# Altium schematic sheet sar20-baseboard-Power.SchDoc
size A4
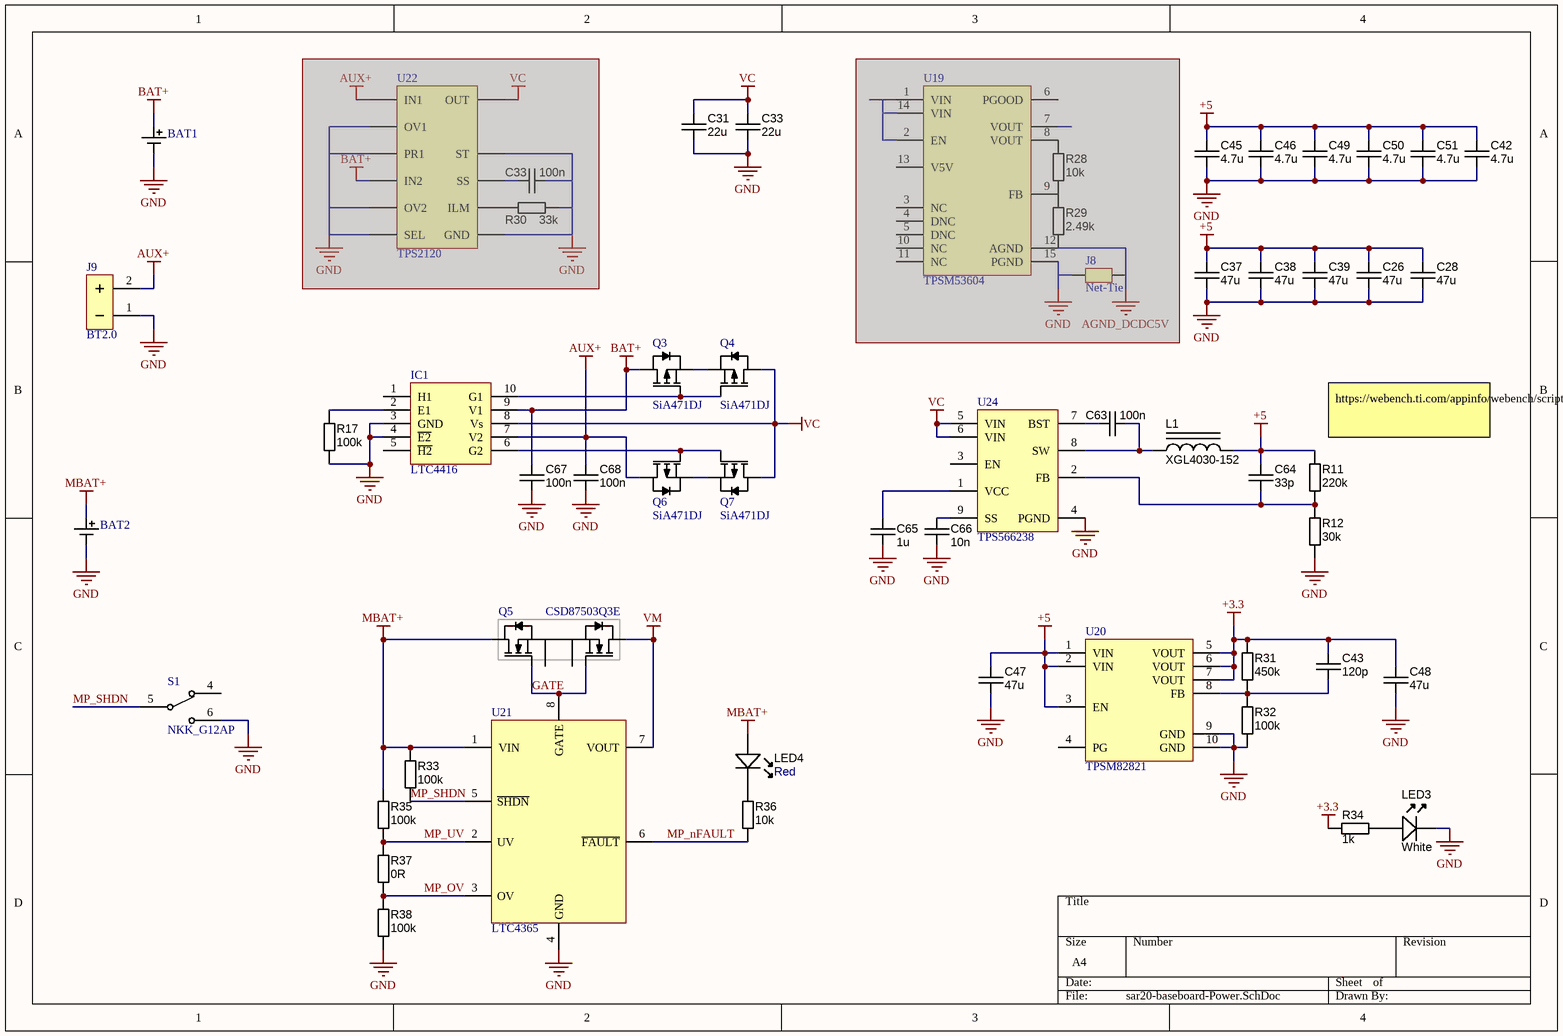
[diagram p0: sar20-baseboard-Power.SchDoc]

## Parts
(Parts that share a designator on the sheet are numbered #1, #2 ... from top to bottom, then left to right.)
BAT1  CUSTOM_BATTERY  [CUSTOM_BATTERY]  (value not drawn)
BAT2  CUSTOM_BATTERY  [CUSTOM_BATTERY]  (value not drawn)
C26  value 47u  [CAPC3216X180N]  (hidden comment: approved sub OK)
C28  value 47u  [CAPC3216X180N]  (hidden comment: approved sub OK)
C31  value 22u  [CAPC3216X180N]  (hidden comment: approved sub OK)
C33#1  value 22u  [CAPC3216X180N]  (hidden comment: approved sub OK)
C33#2  value 100n  [CAPC0603X04N]  (hidden comment: CAPC_100n_0201)  (masked out: inside a compile mask, not in the netlist)
C37  value 47u  [CAPC3216X180N]  (hidden comment: approved sub OK)
C38  value 47u  [CAPC3216X180N]  (hidden comment: approved sub OK)
C39  value 47u  [CAPC3216X180N]  (hidden comment: approved sub OK)
C42  value 4.7u  [CAPC1608X90N]  (hidden comment: approved sub OK)
C43  120p  [CAPC1005X55N]
C45  value 4.7u  [CAPC1608X90N]  (hidden comment: approved sub OK)
C46  value 4.7u  [CAPC1608X90N]  (hidden comment: approved sub OK)
C47  value 47u  [CAPC3216X180N]  (hidden comment: approved sub OK)
C48  value 47u  [CAPC3216X180N]  (hidden comment: approved sub OK)
C49  value 4.7u  [CAPC1608X90N]  (hidden comment: approved sub OK)
C50  value 4.7u  [CAPC1608X90N]  (hidden comment: approved sub OK)
C51  value 4.7u  [CAPC1608X90N]  (hidden comment: approved sub OK)
C63  100n  [CAPC1005X55N]
C64  33p  [CAPC1005X55N]
C65  1u  [CAPC1005X55N]
C66  10n  [CAPC1005X55N]
C67  100n  [CAPC1005X55N]
C68  100n  [CAPC1005X55N]
IC1  LTC4416  [MSOP-10_SMALL_PADS]
J8  Net-Tie  [NET-TIE-0803]  (net tie, no BOM)  (masked out: inside a compile mask, not in the netlist)
J9  BT2.0  [BT2.0-M]
L1  XGL4030-152  [XGL4030]
LED3  White  [LED-0603-WHITE]
LED4  Red  [LED-0603-GREEN]
Q3  SiA471DJ  [VISHAY_PowerPAK_SC70-6L_SINGLE]
Q4  SiA471DJ  [VISHAY_PowerPAK_SC70-6L_SINGLE]
Q5  CSD87503Q3E  [TI_CSD87503Q3E_SON3x3_DTD]
Q6  SiA471DJ  [VISHAY_PowerPAK_SC70-6L_SINGLE]
Q7  SiA471DJ  [VISHAY_PowerPAK_SC70-6L_SINGLE]
R11  value 220k  [RESC1005X40N]  (hidden comment: Thick Film)
R12  value 30k  [RESC1005X40N]  (hidden comment: Thick Film)
R17  value 100k  [RESC1005X40N]  (hidden comment: Thick Film)
R28  value 10k  [RESC1005X40N]  (hidden comment: Thick Film)  (masked out: inside a compile mask, not in the netlist)
R29  value 2.49k  [RESC1005X40N]  (hidden comment: Thick Film)  (masked out: inside a compile mask, not in the netlist)
R30  value 33k  [RESC0603X03N]  (hidden comment: RESC_0201)  (masked out: inside a compile mask, not in the netlist)
R31  value 450k  [RESC1005X40N]  (hidden comment: Thick Film)
R32  value 100k  [RESC1005X40N]  (hidden comment: Thick Film)
R33  value 100k  [RESC1005X40N]  (hidden comment: Thick Film)
R34  value 1k  [RESC1005X40N]  (hidden comment: Thick Film)
R35  value 100k  [RESC1005X40N]  (hidden comment: Thick Film)
R36  value 10k  [RESC1005X40N]  (hidden comment: Thick Film)
R37  value 0R  [RESC1005X40N]  (hidden comment: Thick Film)
R38  value 100k  [RESC1005X40N]  (hidden comment: Thick Film)
S1  NKK_G12AP  [G12AP]
U19  TPSM53604  [TI_B3QFN]  (masked out: inside a compile mask, not in the netlist)
U20  TPSM82821  [TI_uSIP_SIL0010D]
U21  LTC4365  [SOT23-8]
U22  TPS2120  [TI_DSBGA_YFP0020]  (masked out: inside a compile mask, not in the netlist)
U24  TPS566238  [TI_VQFN-HR_RQF0009A]

## Nets
+3.3: C43.1 C48.1 R31.1 R34.1 U20.5(VOUT) U20.6(VOUT) U20.7(VOUT)
+5: C26.1 C28.1 C37.1 C38.1 C39.1 C42.1 C45.1 C46.1 C47.1 C49.1 C50.1 C51.1 C64.2 L1.2 R11.2 U20.1(VIN) U20.2(VIN) U20.3(EN)
AUX+: C68.2 IC1.7(V2) J9.2(+) Q6.D
BAT+: BAT1.PLUS C67.2 IC1.9(V1) Q3.D
GND: BAT1.MINUS BAT2.MINUS C26.2 C28.2 C31.2 C33#1.2 C37.2 C38.2 C39.2 C42.2 C45.2 C46.2 C47.2 C48.2 C49.2 C50.2 C51.2 C65.1 C66.1 C67.1 C68.1 IC1.3(GND) IC1.4(~{E2}) J9.1(-) LED3.K R12.1 R17.2 R32.2 R38.2 S1.6 U20.9(GND) U20.10(GND) U21.4(GND) U24.4(PGND)
MBAT+: BAT2.PLUS LED4.A Q5.D1 R33.1 R35.1 U21.1(VIN)
VC: C31.1 C33#1.1 IC1.8(Vs) Q4.D Q7.D U24.5(VIN) U24.6(VIN)
VM: Q5.D2 U21.7(VOUT)
GATE: Q5.G1 Q5.G2 U21.8(GATE)
MP_nFAULT: R36.2 U21.6(~{FAULT})
MP_OV: R37.2 R38.1 U21.3(OV)
MP_SHDN: R33.2 S1.5 U21.5(~{SHDN})
MP_UV: R35.2 R37.1 U21.2(UV)
NetC43_2: C43.2 R31.2 R32.1 U20.8(FB)
NetC63_1: C63.1 U24.7(BST)
NetC63_2: C63.2 L1.1 U24.8(SW)
NetC64_1: C64.1 R11.1 R12.2 U24.2(FB)
NetC65_2: C65.2 U24.1(VCC)
NetC66_2: C66.2 U24.9(SS)
NetIC1_2: IC1.2(E1) R17.1
NetIC1_6: IC1.6(G2) Q6.G Q7.G
NetIC1_10: IC1.10(G1) Q3.G Q4.G
NetLED3_A: LED3.A R34.2
NetLED4_K: LED4.K R36.1
NetQ3_S: Q3.S Q4.S
NetQ6_S: Q6.S Q7.S

Not connected (* = marked no-connect by the designer): IC1 1(H1) 5(~{H2}); Q5 S1 S2; S1 4; U20 4(PG); U24 3(EN)

## Notes on the sheet
- (near R11) https://webench.ti.com/appinfo/webench/scripts/SDP.cgi?ID=D5932935AECCA692

## Library data of the parts
C26 C28 C31 C33#1 C37-C39 C47 C48 = CAPC_10u_1206_16V: Capacitor SMD Cer 10uF 10% 16V X7R 1206; Manufacturer 1: Kemet; Manufacturer Part Number 1: C1206C106K4RACTU; Ratings: 16V; X7R; Material: ceramic; SCDType: spec; Package / Case: 1206 (3216 metric); Tolerance: ±10%; Supplier 1: Digi-Key; Supplier Part Number 1: 399-3525-1-ND
C42 C45 C46 C49-C51 = CAPC_1u_0603_X7R_16V_10%: Capacitor SMD Cer 1uF 10% 16V X7R 0603; Manufacturer 1: TDK Corporation; Manufacturer Part Number 1: C1608X7R1C105K; Ratings: 16V; X7R; Material: ceramic; SCDType: spec; Package / Case: 0603 (1608 metric); Tolerance: ±10%; Supplier 1: Digi-Key; Supplier Part Number 1: 445-1604-1-ND; ComponentLink1URL: http://product.tdk.com/capacitor/mlcc/en/documents/mlcc_commercial_general_en.pdf; ComponentLink1Description: http://product.tdk.com/capacitor/mlcc/en/documents/mlcc_commercial_general_en.pdf
C43 = CAPC_100p_0402_NP0_50V_5%: Capacitor SMD Cer 100pF 5% 50V NP0 0402; Manufacturer 1: Yageo; Manufacturer Part Number 1: CC0402JRNPO9BN101; Ratings: 50V; NP0; SCDType: spec; Tolerance: ±5%; Operating Temperature: -55°C ~ 125°C; Package / Case: 0402 (1005 Metric); Size / Dimension: 0.039" L x 0.020" W (1.00mm x 0.50mm); Supplier 1: Digi-Key; Supplier Part Number 1: 311-1024-1-ND; RoHS 1: RoHS Compliant; ComponentLink1URL: http://www.yageo.com/documents/recent/UPY-GP_NP0_16V-to-50V_9.pdf; ComponentLink1Description: http://www.yageo.com/documents/recent/UPY-GP_NP0_16V-to-50V_9.pdf; Supplier 2: Digi-Key; Supplier Part Number 2: 1276-1025-1-ND; Manufacturer 2: Samsung Electro-Mechanics America, Inc; Manufacturer Part Number 2: CL05C101JB5NNNC; RoHS 2: RoHS Compliant; ComponentLink2URL: http://www.samsungsem.com/servlet/FileDownload?type=spec&file=CL05C101JB5NNNC.pdf; ComponentLink2Description: http://www.samsungsem.com/servlet/FileDownload?type=spec&file=CL05C101JB5NNNC.pdf; Supplier 3: Digi-Key; Supplier Part Number 3: 445-1247-1-ND; Manufacturer 3: TDK Corporation; Manufacturer Part Number 3: C1005C0G1H101J050BA; RoHS 3: RoHS Compliant; ComponentLink3URL: http://product.tdk.com/capacitor/mlcc/en/documents/mlcc_commercial_general_en.pdf; ComponentLink3Description: http://product.tdk.com/capacitor/mlcc/en/documents/mlcc_commercial_general_en.pdf; Supplier 4: Digi-Key; Supplier Part Number 4: 399-3194-1-ND; Manufacturer 4: Kemet; Manufacturer Part Number 4: C0402C101J5GACTU; RoHS 4: RoHS Compliant; ComponentLink4URL: http://www.kemet.com/datasheets&C0402C101J5GACTU; ComponentLink4Description: http://www.kemet.com/datasheets&C0402C101J5GACTU; Value: 120p
C63-C68 = CAPC_100n_0402_X5R_16V_10%: Capacitor SMD Cer 100nF 10% 16V X5R 0402; Manufacturer 1: AVX Corporation; Manufacturer Part Number 1: 0402YD104KAT2A; Ratings: 16V; X5R; SCDType: spec; Tolerance: ±10%; Operating Temperature: -55°C ~ 125°C; Package / Case: 0402 (1005 Metric); Size / Dimension: 0.039" L x 0.020" W (1.00mm x 0.50mm); Supplier 1: Digi-Key; Supplier Part Number 1: 478-1126-1-ND; ComponentLink1URL: http://www.avx.com/docs/Catalogs/cx5r.pdf; ComponentLink1Description: http://www.avx.com/docs/Catalogs/cx5r.pdf; Supplier 2: Digi-Key; Supplier Part Number 2: 311-1347-1-ND; Manufacturer 2: Yageo; Manufacturer Part Number 2: CC0402KRX5R7BB104; ComponentLink2URL: http://www.yageo.com/documents/recent/UPY-GPHC_X5R_4V-to-50V_12.pdf; ComponentLink2Description: http://www.yageo.com/documents/recent/UPY-GPHC_X5R_4V-to-50V_12.pdf
  C63 C67 C68: Value: 100n
  C64: Value: 33p
  C65: Value: 1u
  C66: Value: 10n
IC1 = LTC4416: PowerPath Controller, 3.6-36V, MSOP-10, LTC4416, Linear Technology; Manufacturer: Analog Devices / Linear Technology; Manufacturer Part Number: LTC4416EMS#PBF; Supply Voltage Range: 3.6V .. 36V; Number of Drivers: 2; Supplier 1: Mouser; Case/Package: MSOP-10; Operating Temperature Range: -40°C .. 85°C; ComponentLink4URL: https://datasheet.ciiva.com/1960/17899-1960765.pdf; ComponentLink4Description: Datasheet; Supplier 2: TME; Supplier Part Number 2: LTC4416EMSPBF; Supplier Part Number 1: 584-LTC4416EMS#PBF
L1 = XGL4030
LED3 = LED_SMD_White_0603_Bright: LED 0603 SMD Bright White 8700K; Manufacturer 1: Lite-On Inc; Manufacturer Part Number 1: LTW-C193TS5; Material: InGaN; Ratings: Ultra Bright; 8700K; Millicandela Rating: 230mcd; Voltage - Forward (Vf) Typ: 3.3V; Viewing Angle: 120°; Lens Type: Clear, Tinted; Lens Style/Size: Rectangle with Flat Top, 0.8mm x 1.1mm; Voltage - Forward (Vf) @ 10mA: 3.0V; SCDType: source; Package / Case: 0603 (1608 metric); Supplier 1: Digi-Key; Supplier Part Number 1: 160-1721-1-ND; Supplier 2: Digi-Key; Supplier Part Number 2: APT1608QWF/D-ND; Manufacturer 2: Kingbright Corp; Manufacturer Part Number 2: APT1608QWF/D; Color: White; Size / Dimension: 1.60mm L x 0.80mm W; Mounting Type: Surface Mount; Luminous Flux @ Current - Test: -; ComponentLink2URL: http://www.kingbrightusa.com/images/catalog/SPEC/APT1608QWF-D.pdf; ComponentLink2Description: http://www.kingbrightusa.com/images/catalog/SPEC/APT1608QWF-D.pdf; ComponentLink1URL: http://media.digikey.com/pdf/Data%20Sheets/Lite-On%20PDFs/LTW-C193TS5.pdf; ComponentLink1Description: http://media.digikey.com/pdf/Data%20Sheets/Lite-On%20PDFs/LTW-C193TS5.pdf
LED4 = LED_SMD_Green_0603_525nm_350mcd: LED 0603 SMD Green 525nm 350mcd 20mA; Manufacturer 1: Kingbright; Manufacturer Part Number 1: APT1608ZGCK; Material: InGaN; Ratings: 200mcd min; 350 mcd typ @ 20mA; Voltage - Forward (Vf) @ 10mA: 3.1V; Viewing Angle: 120°; Lens Style/Size: Rectangle with Flat Top, 1.2mm x 0.8mm; Voltage - Forward (Vf) @ 20mA: 3.3V; SCDType: source; Package / Case: 0603 (1608 metric); Color: Green; Current - Test: 20mA; Manufacturer 2: Kingbright Company LLC; Manufacturer Part Number 2: APT1608-WAP24; Supplier 1: Mouser; Supplier Part Number 1: 604-APT1608ZGCK; ComponentLink1URL: http://www.mouser.com/ds/2/216/APT1608ZGCK-262051.pdf; ComponentLink1Description: http://www.mouser.com/ds/2/216/APT1608ZGCK-262051.pdf; ComponentLink2Description: APT1608-WAP24 Datasheet; ComponentLink2URL: \\SVFI2\PBLShare\Eng\Electrical Engineering\Hardware\Altium\Libraries and Templates\Unreleased Components\Part Number Request 2013-10-02\APT1608-WAP24(Ver.1B).pdf
R11 R12 R28 R29 R36 = RES_10K_0402_1%: Resistor SMD chip 10k Ohm 0.063W 1% 0402; Manufacturer 1: Vishay Dale; Manufacturer Part Number 1: CRCW040210K0FKED; Ratings: 1/16 W; SCDType: spec; Package / Case: 0402 (1005 Metric); Manufacturer 2: Yageo; Manufacturer Part Number 2: RC0402FR-0710KL; Supplier 1: Digi-Key; Supplier Part Number 1: 541-10.0KLCT-ND; ComponentLink1URL: http://www.vishay.com/doc?20035; ComponentLink1Description: http://www.vishay.com/doc?20035; Supplier 2: Digi-Key; Supplier Part Number 2: 311-10.0KLRCT-ND; ComponentLink2URL: http://www.yageo.com/documents/recent/PYu-RC0402_51_RoHS_L_6.pdf; ComponentLink2Description: http://www.yageo.com/documents/recent/PYu-RC0402_51_RoHS_L_6.pdf; Tolerance: ±1%
R17 R31-R33 R35 R38 = RES_100K_0402_5%: Resistor SMD chip 100k Ohm 0.063W 5% 0402; Manufacturer 1: Vishay Dale; Manufacturer Part Number 1: CRCW0402100KJNED; Ratings: 1/16 W; SCDType: undef; Package / Case: 0402 (1005 Metric); Tolerance: ±5%; ComponentLink2URL: http://www.yageo.com/documents/recent/PYu-RC0402_51_RoHS_L_6.pdf; ComponentLink2Description: http://www.yageo.com/documents/recent/PYu-RC0402_51_RoHS_L_6.pdf; Supplier 1: Digi-Key; Supplier Part Number 1: 541-100KJCT-ND; ComponentLink1URL: http://www.vishay.com/doc?20035; ComponentLink1Description: http://www.vishay.com/doc?20035; Supplier 2: Digi-Key; Supplier Part Number 2: 311-100KJRCT-ND; Manufacturer 2: Yageo; Manufacturer Part Number 2: RC0402JR-07100KL
R34 R37 = RES_1K_0402_5%: Resistor SMD chip 1k Ohm 0.063W 5% 0402; Manufacturer 1: Yageo; Manufacturer Part Number 1: RC0402JR-071KL; Ratings: 1/16 W; SCDType: spec; Package / Case: 0402 (1005 Metric); Tolerance: ±5%; Supplier 1: Digi-Key; Supplier Part Number 1: 311-1.0KJRCT-ND; RoHS 1: RoHS Compliant; ComponentLink1URL: http://www.yageo.com/documents/recent/PYu-RC0402_51_RoHS_L_6.pdf; ComponentLink1Description: http://www.yageo.com/documents/recent/PYu-RC0402_51_RoHS_L_6.pdf; Supplier 2: Digi-Key; Supplier Part Number 2: 541-1.0KJCT-ND; Manufacturer 2: Vishay Dale; Manufacturer Part Number 2: CRCW04021K00JNED; RoHS 2: RoHS Compliant; ComponentLink2URL: http://www.vishay.com/doc?20035; ComponentLink2Description: http://www.vishay.com/doc?20035; Supplier 3: Digi-Key; Supplier Part Number 3: 1276-4376-1-ND; Manufacturer 3: Samsung Electro-Mechanics America, Inc; Manufacturer Part Number 3: RC1005J102CS; RoHS 3: RoHS Compliant; ComponentLink3URL: http://www.samsungsem.com/servlet/FileDownload?filename=productcatalog/pdf/Chip_Resistor.pdf; ComponentLink3Description: http://www.samsungsem.com/servlet/FileDownload?filename=productcatalog/pdf/Chip_Resistor.pdf; Supplier 4: Digi-Key; Supplier Part Number 4: RHM1.0KCECT-ND; Manufacturer 4: Rohm Semiconductor; Manufacturer Part Number 4: MCR01MRTJ102; RoHS 4: RoHS Compliant; ComponentLink4URL: http://rohmfs.rohm.com/en/products/databook/datasheet/passive/resistor/chip_resistor/mcr_g.pdf; ComponentLink4Description: http://rohmfs.rohm.com/en/products/databook/datasheet/passive/resistor/chip_resistor/mcr_g.pdf; Supplier 5: Digi-Key; Supplier Part Number 5: P1.0KJCT-ND; Manufacturer 5: Panasonic Electronic Components; Manufacturer Part Number 5: ERJ-2GEJ102X; RoHS 5: RoHS Compliant; ComponentLink5URL: http://industrial.panasonic.com/www-cgi/jvcr13pz.cgi?E+PZ+3+AOA0001+ERJ2GEJ102X+7+WW; ComponentLink5Description: http://industrial.panasonic.com/www-cgi/jvcr13pz.cgi?E+PZ+3+AOA0001+ERJ2GEJ102X+7+WW
U22 = TPS2120: pin to pad: 1>A1 2>A2 3>A3 4>A4 5>B1+B2+C1 6>B3+B4+C4 7>C2+C3+D1+D2+D3+D4 8>E1 9>E2 10>E3 11>E4